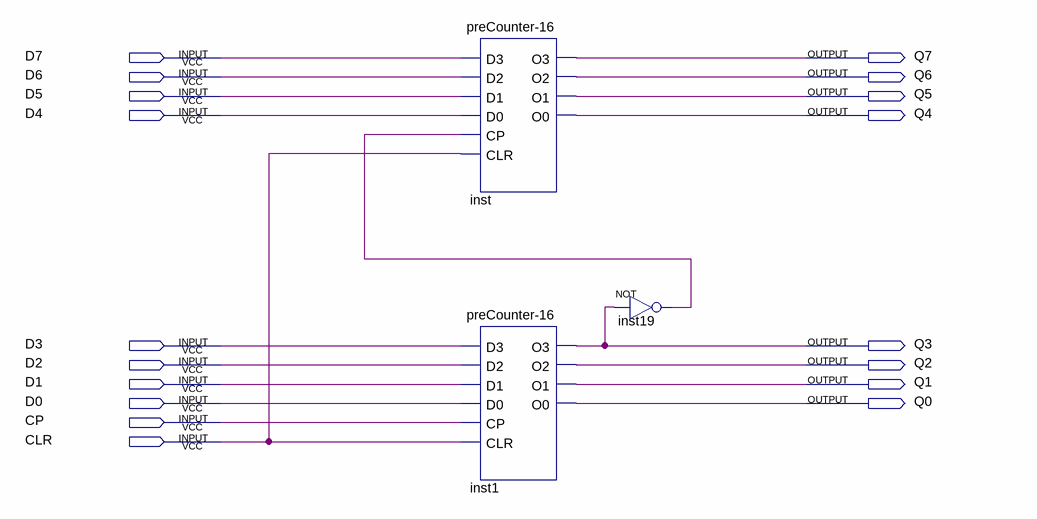
[diagram p0: schematic sheet]
// Quartus schematic preCounter-256.bdf as structural Verilog: 3 symbols, 18 pins
module \preCounter-256  (
  input  D7,
  input  D6,
  input  D5,
  input  D4,
  input  D3,
  input  D2,
  input  D1,
  input  D0,
  input  CP,
  input  CLR,
  output Q7,
  output Q6,
  output Q5,
  output Q4,
  output Q3,
  output Q2,
  output Q1,
  output Q0
);

  wire inst19_out;

  \preCounter-16  inst (
    .D3(D7), .D2(D6), .D1(D5), .D0(D4), .CP(inst19_out), .CLR(CLR), .O3(Q7), .O2(Q6), .O1(Q5), .O0(Q4));
  \preCounter-16  inst1 (.D3(D3), .D2(D2), .D1(D1), .D0(D0), .CP(CP), .CLR(CLR), .O3(Q3), .O2(Q2), .O1(Q1), .O0(Q0));
  not inst19 (inst19_out, Q3);
endmodule
